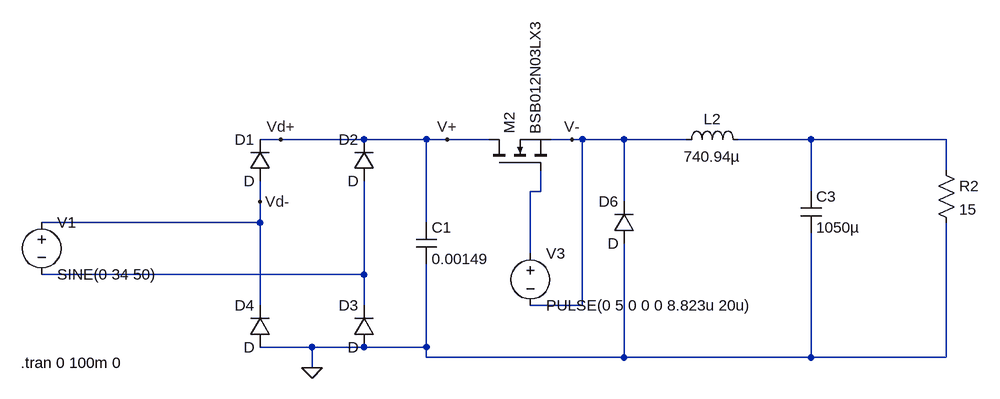
[diagram p0: schematic Rectifier-1.asc]
Rectifier-1.asc, the LTspice schematic file:
Version 4
SHEET 1 1816 680
WIRE 64 16 32 16
WIRE 192 16 64 16
WIRE 288 16 192 16
WIRE 320 16 288 16
WIRE 384 16 320 16
WIRE 512 16 480 16
WIRE 528 16 512 16
WIRE 592 16 528 16
WIRE 688 16 592 16
WIRE 880 16 768 16
WIRE 1088 16 880 16
WIRE 1088 64 1088 16
WIRE 464 96 464 64
WIRE 464 96 448 96
WIRE 880 96 880 16
WIRE 32 112 32 80
WIRE 592 112 592 16
WIRE 32 144 32 112
WIRE 32 144 -304 144
WIRE 288 144 288 16
WIRE 448 192 448 96
WIRE 192 224 192 80
WIRE 192 224 -304 224
WIRE 32 272 32 144
WIRE 192 272 192 224
WIRE 528 272 528 16
WIRE 528 272 448 272
WIRE 112 336 32 336
WIRE 192 336 112 336
WIRE 288 336 288 208
WIRE 288 336 192 336
WIRE 288 352 288 336
WIRE 592 352 592 176
WIRE 592 352 288 352
WIRE 880 352 880 160
WIRE 880 352 592 352
WIRE 1088 352 1088 144
WIRE 1088 352 880 352
WIRE 112 368 112 336
FLAG 112 368 0
FLAG 64 16 Vd+
FLAG 32 112 Vd-
FLAG 512 16 V-
FLAG 320 16 V+
SYMBOL voltage -304 128 R0
WINDOW 123 0 0 Left 0
WINDOW 39 0 0 Left 0
SYMATTR InstName V1
SYMATTR Value SINE(0 34 50)
SYMBOL cap 272 144 R0
SYMATTR InstName C1
SYMATTR Value 0.00149
SYMBOL diode 48 80 R180
WINDOW 0 24 64 Left 2
WINDOW 3 24 0 Left 2
SYMATTR InstName D1
SYMBOL diode 208 80 R180
WINDOW 0 24 64 Left 2
WINDOW 3 24 0 Left 2
SYMATTR InstName D2
SYMBOL diode 208 336 R180
WINDOW 0 24 64 Left 2
WINDOW 3 24 0 Left 2
SYMATTR InstName D3
SYMBOL diode 48 336 R180
WINDOW 0 24 64 Left 2
WINDOW 3 24 0 Left 2
SYMATTR InstName D4
SYMBOL diode 608 176 R180
WINDOW 0 24 64 Left 2
WINDOW 3 24 0 Left 2
SYMATTR InstName D6
SYMBOL nmos 384 64 R270
SYMATTR InstName M2
SYMATTR Value BSB012N03LX3
SYMBOL ind 672 32 R270
WINDOW 0 32 56 VTop 2
WINDOW 3 5 56 VBottom 2
SYMATTR InstName L2
SYMATTR Value 740.94µ
SYMBOL cap 864 96 R0
SYMATTR InstName C3
SYMATTR Value 1050µ
SYMBOL res 1072 48 R0
SYMATTR InstName R2
SYMATTR Value 15
SYMBOL voltage 448 176 R0
WINDOW 123 0 0 Left 0
WINDOW 39 0 0 Left 0
SYMATTR InstName V3
SYMATTR Value PULSE(0 5 0 0 0 8.823u 20u)
TEXT -336 360 Left 2 !.tran 0 100m 0

The netlist it stands for:
* Rectifier-1.asc
V1 Vd- N003 SINE(0 34 50)
C1 V+ 0 0.00149
D1 Vd- V+ D
D2 N003 V+ D
D3 0 N003 D
D4 0 Vd- D
D6 0 V- D
M2 V+ N002 V- V- BSB012N03LX3
L2 V- N001 740.94µ
C3 N001 0 1050µ
R2 N001 0 15
V3 N002 V- PULSE(0 5 0 0 0 8.823u 20u)
.model D D
.lib standard.dio
.model NMOS NMOS
.model PMOS PMOS
.lib standard.mos
.tran 0 100m 0
.backanno
.end